# EAGLE design Virtual-Ground (EAGLE 6.6.0)
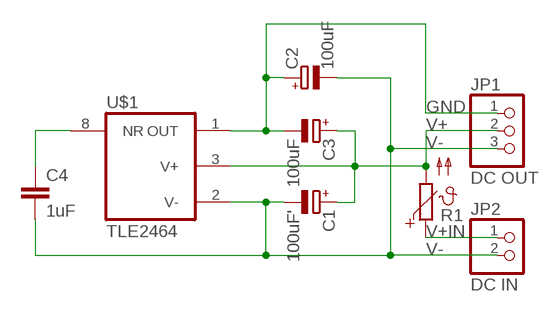
[diagram p0: schematic, sheet 1]

## Parts
C1  100uF'  CPOL-EUE2.5-6  [E2,5-6]
C2  100uF  CPOL-EUE2.5-6  [E2,5-6]
C3  100uF  CPOL-EUE2.5-6  [E2,5-6]
C4  1uF  C-EU050-050X075  [C050-050X075]
JP1  DC OUT  PINHD-1X3  [1X03]
JP2  DC IN  PINHD-1X2  [1X02]
R1  PTC660  [P660]
U$1  TLE2464  [TLE2464]

## Nets
GND: C2.+ C3.- JP1.1 U$1.1(OUT)
N$5: C4.1 U$1.8(NR)
V+: C1.+ C3.+ JP1.2 R1.2 U$1.3(V+)
V+IN: JP2.1 R1.1
V-: C1.- C2.- C4.2 JP1.3 JP2.2 U$1.2(V-)

## Library data of the parts
C1-C3 = rcl:CPOL-EU: POLARIZED CAPACITOR, European symbol
C4 = rcl:C-EU: CAPACITOR, European symbol
JP1 = pinhead:PINHD-1X3: PIN HEADER
JP2 = pinhead:PINHD-1X2: PIN HEADER
R1 = ptc-ntc:PTC660: PHILIPS PTC; OC_FARNELL: unknown; OC_NEWARK: unknown
U$1 = Mylib:TLE2464: Rail Splitter

## Board
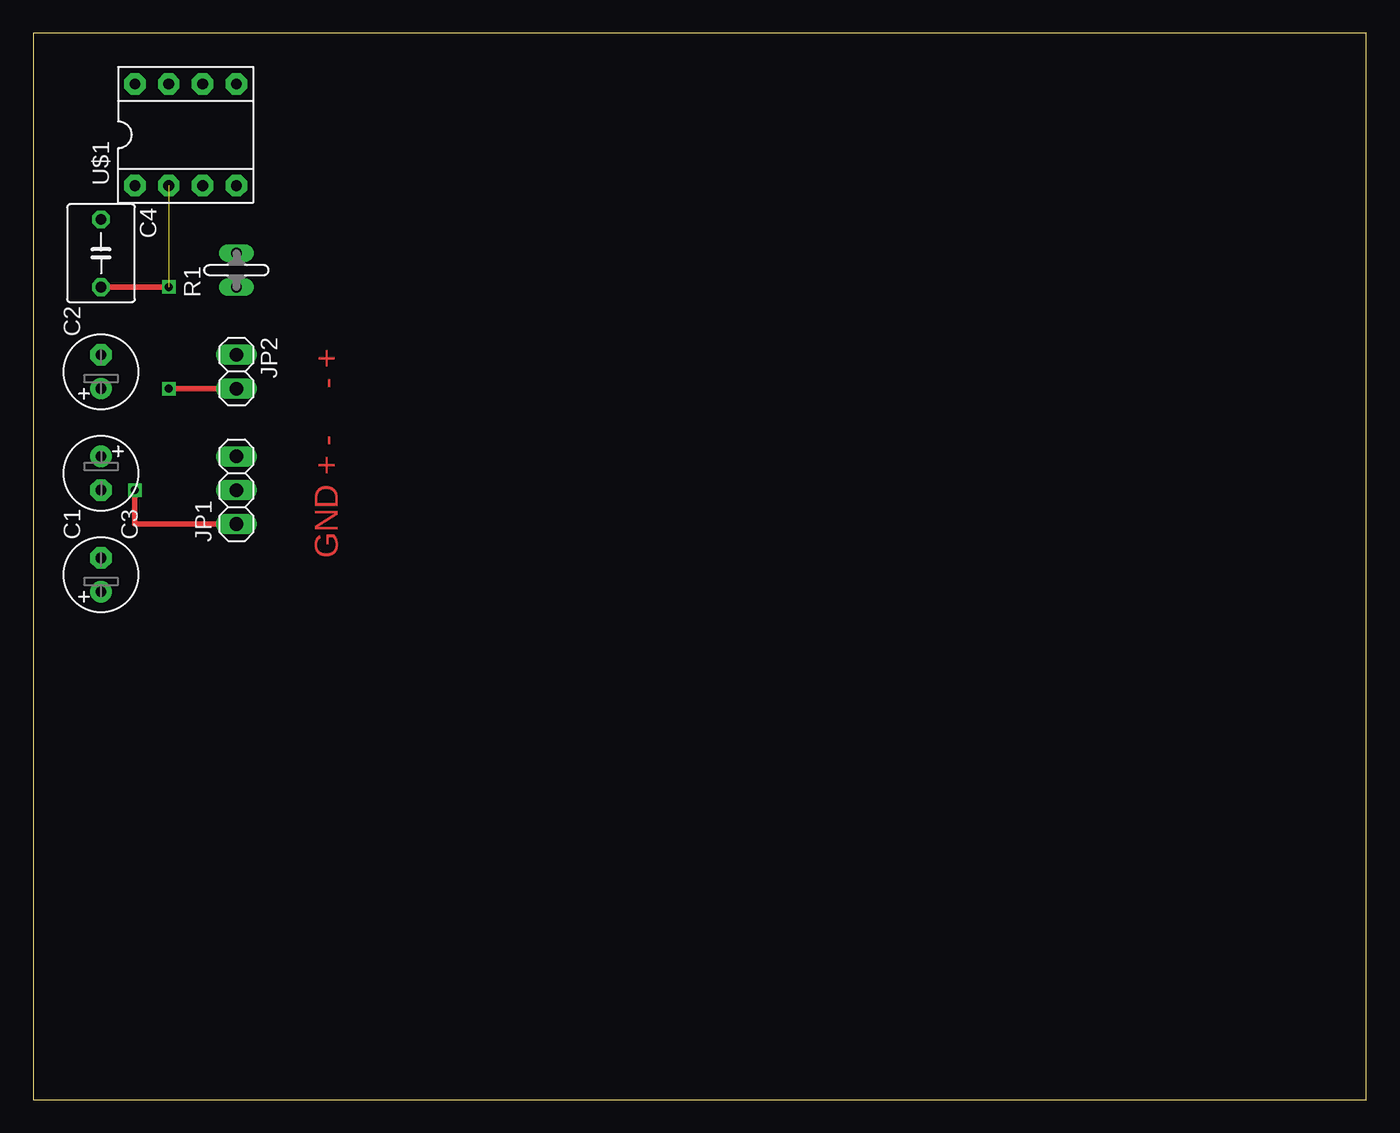
[diagram p1: board, top side]
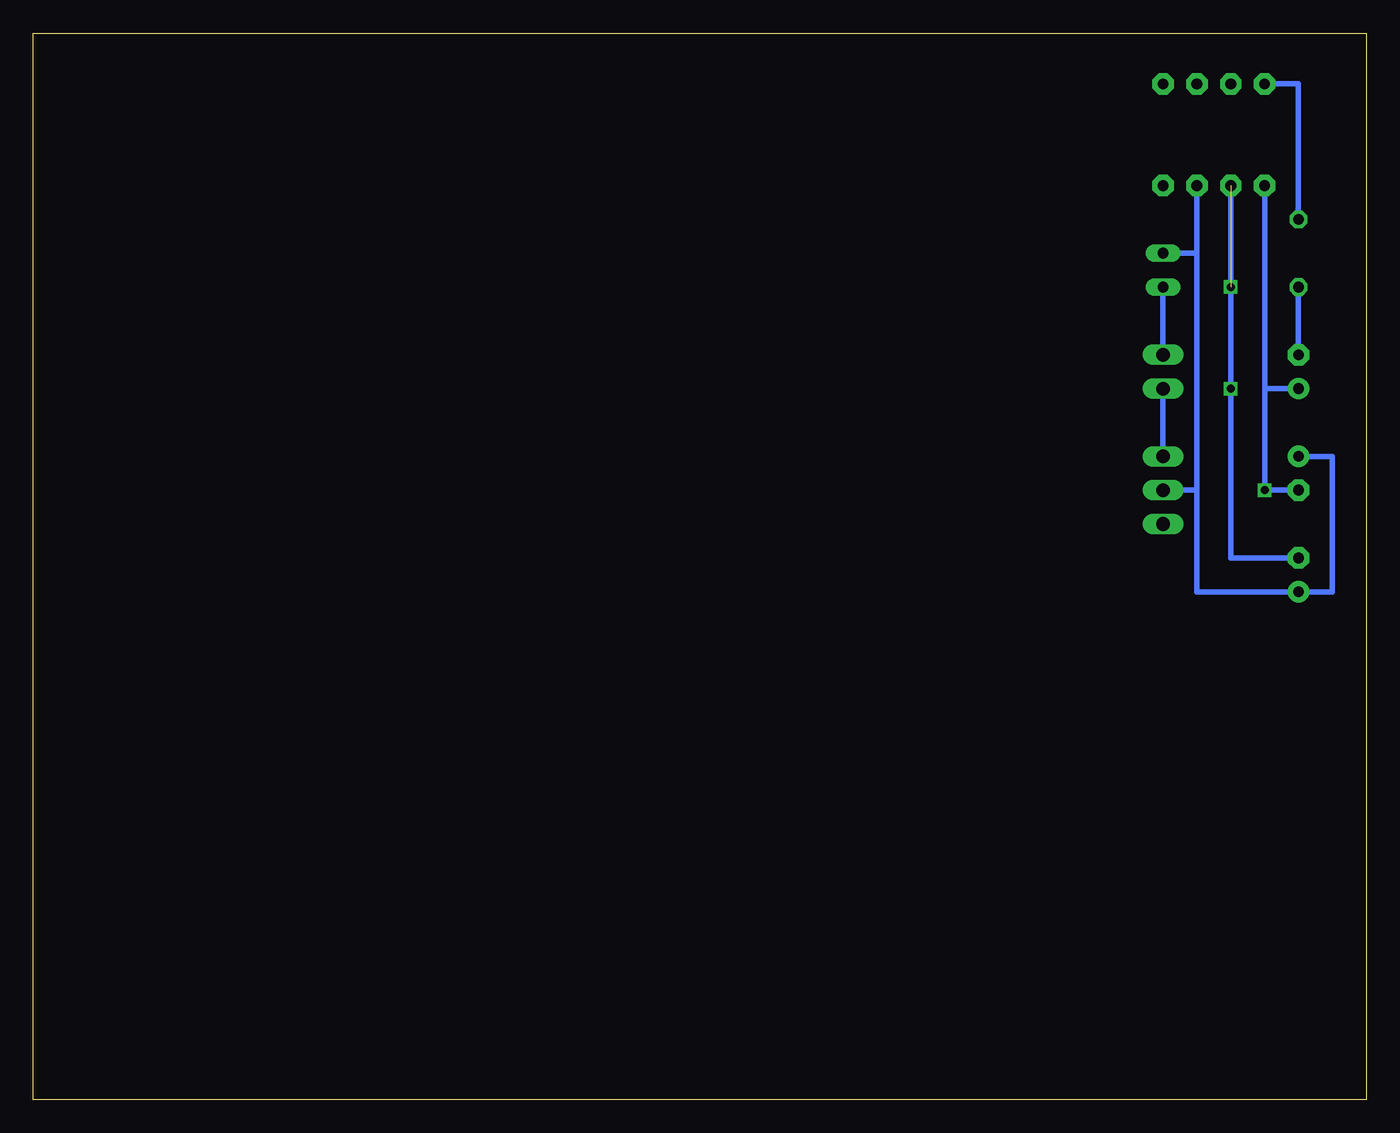
[diagram p2: board, bottom side, seen from below]

Size 100 x 80 mm. Coordinates in mm from the lower left corner, seen from the top.
Outline: 0,0 100,0 100,80 0,80 0,0
Copper layers (1*16): Top 0.035mm / dielectric 1.5mm / Bottom 0.035mm
Design rules "default": minimum track width 10mil, minimum drill 24mil, track to track 8mil, track to pad 8mil, pad to pad 8mil, via to via 8mil, smd to smd 8mil, copper to edge 40mil, drill to drill 8mil, minimum pad ring 10mil, minimum via ring 8mil, stop-mask expansion 4mil, vias tented up to drill 0mil, thermal gap 10mil

### Footprints (pad centres in the part's own frame; a part is rotated, then mirrored left to right if it is on the bottom)
E2,5-6 = drill 0.813 pad 1.6: + -1.27,0 | drill 0.813 pad 1.6 octagon: - 1.27,0
C050-050X075 = drill 0.813 octagon: 1 -2.54,0; 2 2.54,0
1X03 = drill 1.016 long: 1 -2.54,0; 2 0,0; 3 2.54,0
1X02 = drill 1.016 long: 1 -1.27,0; 2 1.27,0
P660 = drill 0.813 long: 1 -1.27,0; 2 1.27,0
TLE2464 = drill 0.813 pad 1.6 octagon: 1 -3.81,-3.81; 2 -1.27,-3.81; 3 1.27,-3.81; 4 3.81,-3.81; 5 3.81,3.81; 6 1.27,3.81; 7 -1.27,3.81; 8 -3.81,3.81

### Placement (x,y rotation side)
C1  5.08,39.37 90 top
C2  5.08,54.61 90 top
C3  5.08,46.99 270 top
C4  5.08,63.5 270 top
JP1  15.24,45.72 90 top
JP2  15.24,54.61 270 top
R1  15.24,62.23 90 top
U$1  11.43,72.39 0 top

### Tracks (layer width: path | path; a pad name or v marks a point on that pad's centre or on a via)
GND  (via drill 0.6)
  Top 0.406: JP1.1 7.62,43.18 v7.62,45.72
  Bottom 0.406: U$1.1 7.62,53.34 | C2.+ 7.62,53.34 | 7.62,53.34 v7.62,45.72 C3.-
N$5
  Bottom 0.406: U$1.8 5.08,76.2 C4.1
V+
  Bottom 0.406: U$1.3 12.7,63.5 | 12.7,63.5 12.7,45.72 | 12.7,45.72 12.7,38.1 C1.+ 2.54,38.1 2.54,48.26 C3.+ | JP1.2 12.7,45.72 | R1.2 12.7,63.5
V+IN
  Bottom 0.406: R1.1 JP2.1
V-  (via drill 0.6)  (1 unrouted)
  Top 0.406: JP2.2 v10.16,53.34 | C4.2 v10.16,60.96
  Bottom 0.406: U$1.2 v10.16,60.96 v10.16,53.34 10.16,40.64 C1.- | JP2.2 JP1.3 | C2.- C4.2

### Text on the board
Top: - + | GND + -